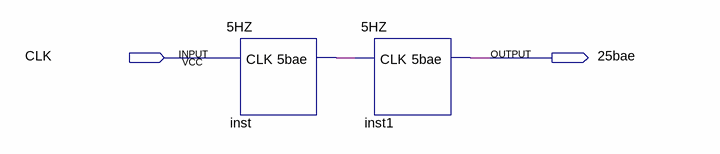
[diagram p0: schematic sheet]
// Quartus schematic 25HZ.bdf as structural Verilog: 2 symbols, 2 pins
module \25HZ  (
  input  CLK,
  output \25bae 
);

  wire inst_5bae;

  \5HZ  inst (.CLK(CLK), .\5bae (inst_5bae));
  \5HZ  inst1 (.CLK(inst_5bae), .\5bae (\25bae ));
endmodule
